# EAGLE design 18650 Test (EAGLE 6.5.0)
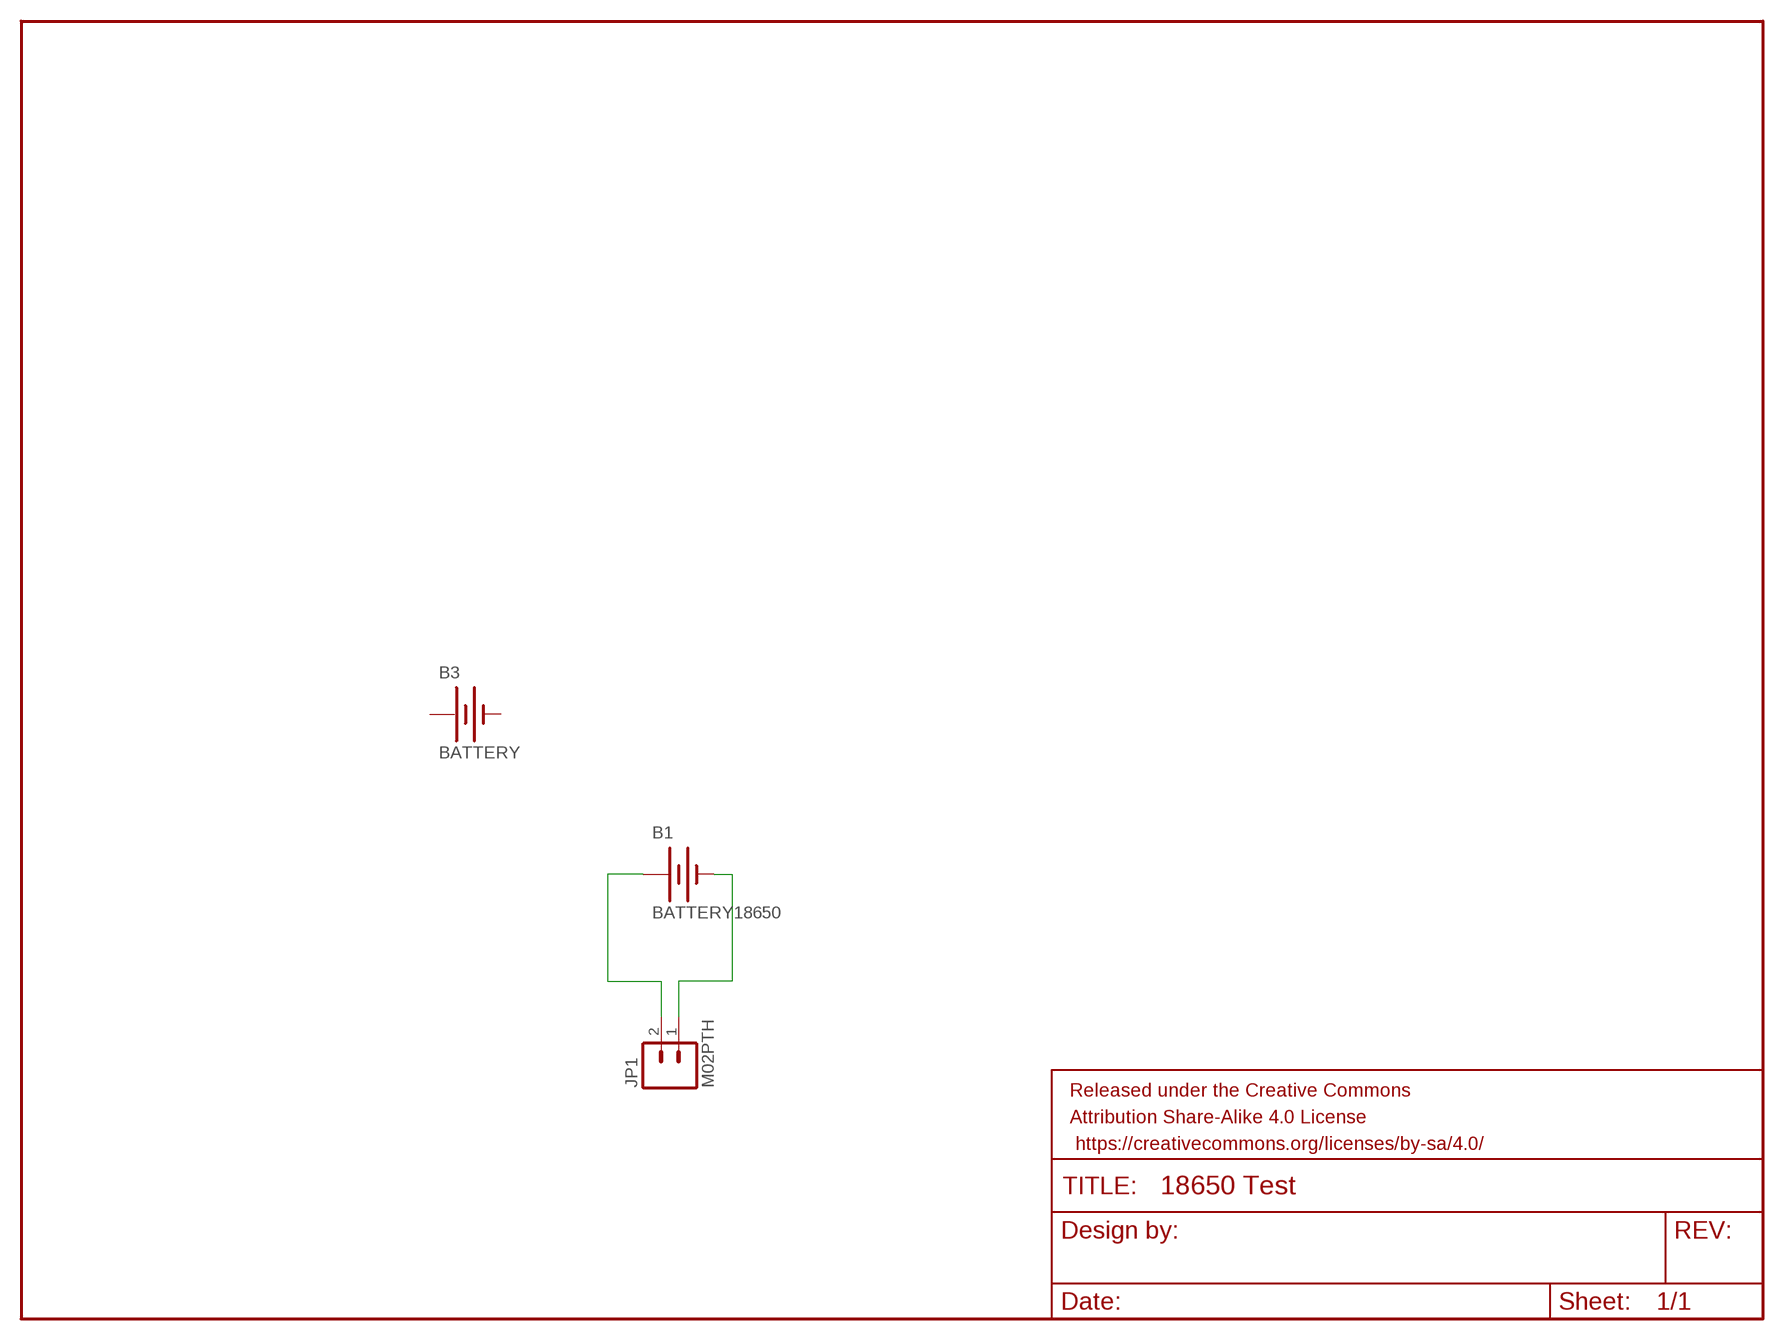
[diagram p0: schematic, sheet 1]

## Parts
B1  BATTERY18650  [18650-HOLDER]
B3  BATTERY  [18650-TEST]
FRAME1  FRAME-LETTER  [CREATIVE_COMMONS]
JP1  M02PTH  [1X02]

## Nets
GND: B1.GND@1(-) JP1.1
VCC: B1.PWR@1(+) JP1.2

## Power pins joined to a net without a drawn wire
+: B3.PWR@4(+)
-: B3.PWR@3(-)

## Library data of the parts
B1 B3 = bq769x0:BATTERY
FRAME1 = SparkFun-Aesthetics:FRAME-LETTER: Schematic Frame Standard 8.5x11 US Letter frame
JP1 = SparkFun-Connectors:M02: Standard 2-pin 0.1" header. Use with - straight break away headers ( PRT-00116) - right angle break away headers (PRT-00553) - swiss pins (PRT-00743) - machine pins (PRT-00117) - female headers (PRT-00115) Molex polarized connector foot print use with: PRT-08233 with associated crimp pins and housings. 2.54_SCREWTERM for use with PRT-10571. 3.5mm Screw Terminal footprints for PRT-08084 5mm Screw Terminal footprints for use with PRT-08432

## Board
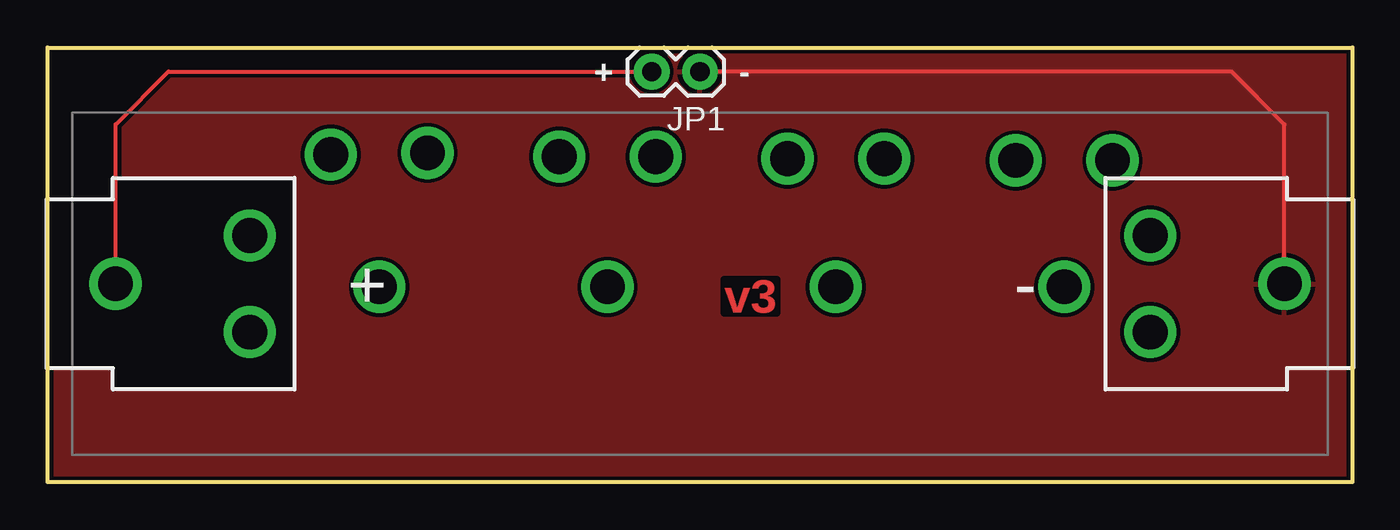
[diagram p1: board, top side]
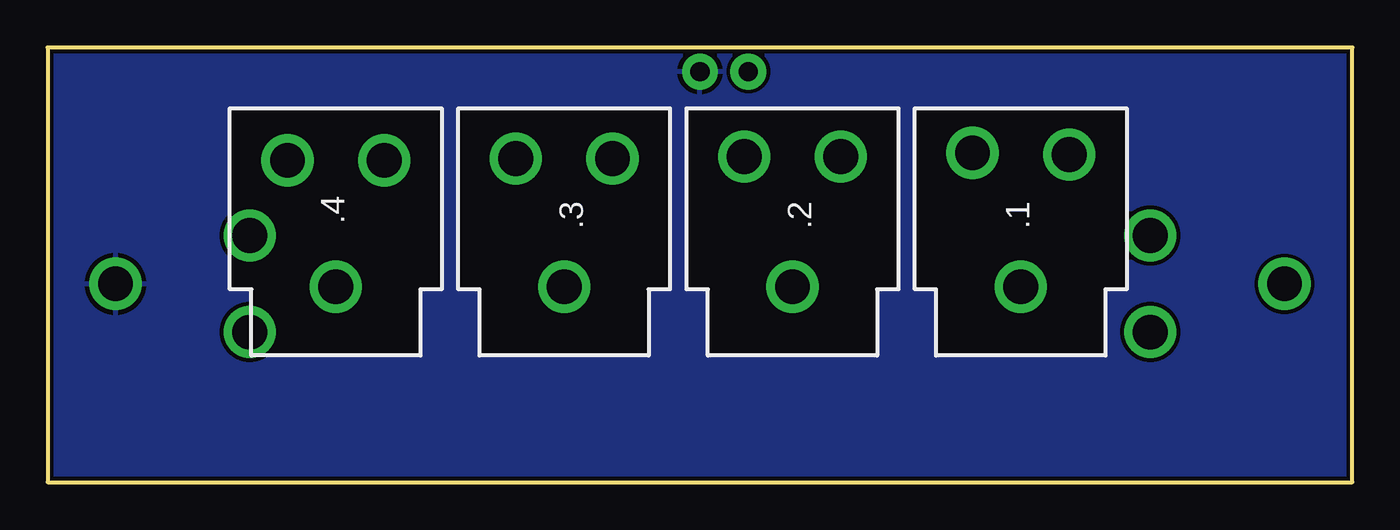
[diagram p2: board, bottom side, seen from below]

Size 68.58 x 22.86 mm. Coordinates in mm from the lower left corner, seen from the top.
Outline: 0,22.86 68.58,22.86 68.58,0 0,0 0,22.86
Copper layers (1*16): Top 0.035mm / dielectric 1.5mm / Bottom 0.035mm
Design rules "default *": minimum track width 8mil, minimum drill 20mil, track to track 8mil, track to pad 8mil, pad to pad 8mil, via to via 8mil, smd to smd 8mil, copper to edge 8mil, drill to drill 8mil, minimum pad ring 12mil, minimum via ring 10mil, stop-mask expansion 4mil, vias tented up to drill 20mil, thermal gap 10mil

### Footprints (pad centres in the part's own frame; a part is rotated, then mirrored left to right if it is on the bottom)
18650-HOLDER = drill 1.829: GND@1 30.718,0; GND@2 23.67,-2.54; GND@3 23.67,2.54; PWR@1 -30.718,0; PWR@4 -23.67,-2.54; PWR@6 -23.67,2.54
18650-TEST = drill 1.829: PWR@3 -10.048,6; PWR@4 -3.1,3.46; PWR@5 -3.2,15.46; PWR@6 -3,8.54; PWR@7 -10.048,18; PWR@8 -3.2,20.54; PWR@9 -3.3,27.46; PWR@10 -10.048,30; PWR@11 -3.3,32.54; PWR@12 -3.4,39.46; PWR@13 -10.048,42; PWR@14 -3.4,44.54
1X02 = drill 1.016 pad 1.88: 1 0,0; 2 2.54,0

### Placement (x,y rotation side)
B1  34.29,10.43 0 top
B3  11.43,20.32 90 bottom
FRAME1  -0.65,-21.59 0 top  (outside the outline)
JP1  34.29,21.59 180 top

### Tracks (layer width: path | path; a pad name or v marks a point on that pad's centre or on a via)
GND
  Top 0.203: B1.GND@1 65.01,18.81 62.23,21.59 JP1.1
  pour Top: 0,0 0,22.86 68.58,22.86 68.58,0
  pour Bottom: 0,0 0,22.86 68.58,22.86 68.58,0
VCC
  Top 0.203: B1.PWR@1 3.57,18.81 6.35,21.59 JP1.2

### Text on the board
Top: v3
tPlace: + | -